# EAGLE design mike_sims_vca (EAGLE 7.1.0)
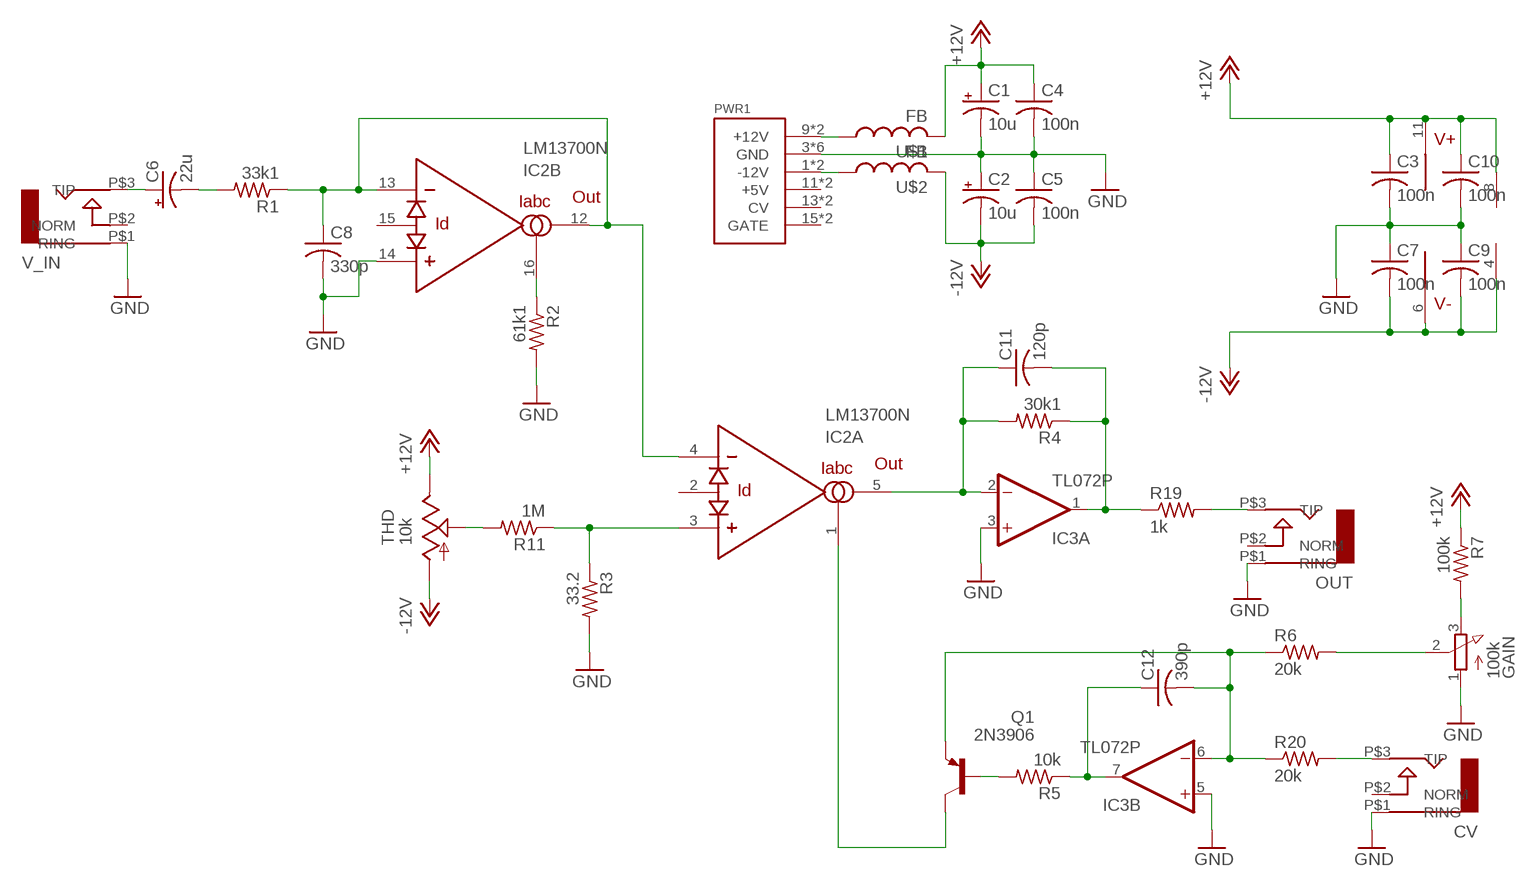
[diagram p0: schematic, sheet 1]

## Parts
C1  10u  CPOL-USB45181A  [B45181A]
C2  10u  CPOL-USB45181A  [B45181A]
C3  100n  C-US050-024X044  [C050-024X044]
C4  100n  C-US050-024X044  [C050-024X044]
C5  100n  C-US050-024X044  [C050-024X044]
C6  22u  CPOL-USB45181A  [B45181A]
C7  100n  C-US050-024X044  [C050-024X044]
C8  330p  C-US050-024X044  [C050-024X044]
C9  100n  C-US050-024X044  [C050-024X044]
C10  100n  C-US050-024X044  [C050-024X044]
C11  120p  C-US050-024X044  [C050-024X044]
C12  390p  C-US050-024X044  [C050-024X044]
CV  AUDIO-JACK  [ERTHENVAR-JACK-90DEG]
GAIN  100k  3RP/1610N  [3RP/1610N]
IC2  LM13700N  [DIL16]
IC3  TL072P  [DIL08]
OUT  AUDIO-JACK  [ERTHENVAR-JACK-90DEG]
PWR1  POWER  [POWER_16]
Q1  2N3906  [TO92]
R1  33k1  R-US_0207/10  [0207/10]
R2  61k1  R-US_0207/10  [0207/10]
R3  33.2  R-US_0207/10  [0207/10]
R4  30k1  R-US_0207/10  [0207/10]
R5  10k  R-US_0207/10  [0207/10]
R6  20k  R-US_0207/10  [0207/10]
R7  100k  R-US_0207/10  [0207/10]
R11  1M  R-US_0207/10  [0207/10]
R19  1k  R-US_0207/10  [0207/10]
R20  20k  R-US_0207/10  [0207/10]
THD  10k  TRIM_US-B64Y  [B64Y]
U$1  FB  [FB]
U$2  FB  [FB]
V_IN  AUDIO-JACK  [ERTHENVAR-JACK-90DEG]

## Nets
+12V: C1.+ C3.1 C4.1 C10.1 IC2.11(V+) IC3.8(P:V+) R7.1 THD.E U$1.P$2
-12V: C2.- C5.2 C7.2 C9.2 IC2.6(V-) IC3.4(P:V-) THD.A U$2.P$2
GND: C1.- C2.+ C3.2 C4.2 C5.1 C7.1 C8.2 C9.1 C10.2 CV.P$1(RING) GAIN.1(A) IC2.14(B:+IN) IC3.3(A:+IN) IC3.5(B:+IN) OUT.P$1(RING) PWR1.3(GND) PWR1.4(GND) PWR1.5(GND) PWR1.6(GND) PWR1.7(GND) PWR1.8(GND) R2.2 R3.2 V_IN.P$1(RING)
N$1: PWR1.9(+12V) PWR1.10(+12V) U$1.P$1
N$2: PWR1.1(-12V) PWR1.2(-12V) U$2.P$1
N$3: C6.+ V_IN.P$3(TIP)
N$4: C6.- R1.2
N$5: C8.1 IC2.4(A:-IN) IC2.12(B:OUT) IC2.13(B:-IN) R1.1
N$6: IC2.3(A:+IN) R3.1 R11.1
N$7: IC2.16(B:IABC) R2.1
N$8: C11.2 IC3.1(A:OUT) R4.1 R19.1
N$9: C11.1 IC2.5(A:OUT) IC3.2(A:-IN) R4.2
N$10: Q1.2(B) R5.2
N$11: C12.1 IC3.7(B:OUT) R5.1
N$12: GAIN.2(S) R6.2
N$13: GAIN.3(E) R7.2
N$19: R11.2 THD.S
N$20: C12.2 IC3.6(B:-IN) Q1.3(E) R6.1 R20.1
N$21: IC2.1(A:IABC) Q1.1(C)
N$24: OUT.P$3(TIP) R19.2
N$25: CV.P$3(TIP) R20.2
Unconnected: CV.P$2(NORM) IC2.2(A:ID) IC2.7(IN) IC2.8(OUT) IC2.9(OUT) IC2.10(IN) IC2.15(B:ID) OUT.P$2(NORM) PWR1.11(+5V) PWR1.12(+5V) PWR1.13(CV) PWR1.14(CV) PWR1.15(GATE) PWR1.16(GATE) V_IN.P$2(NORM)

## Library data of the parts
C1 C2 C6 = rcl:CPOL-US: POLARIZED CAPACITOR, American symbol
C3-C5 C7-C12 = rcl:C-US: CAPACITOR, American symbol
CV OUT V_IN = erthenvar:AUDIO-JACK: Switching Mono 3.5mm Audio Jack from Erthenvar.
GAIN = pot:3RP/1610N: 16mm Potentiometer one level Source: http://www.alphapotentiometers.net/html/16mm_pot_2.html
IC2 = synthdiy updated imperial:LM13700: National Dual OTA with buffers.
IC3 = linear:TL072: OP AMP
PWR1 = eurorack:POWER
Q1 = transistor-pnp:2N3906: PNP Transistor
R1-R7 R11 R19 R20 = rcl:R-US_: RESISTOR, American symbol
THD = pot:TRIM_US-: POTENTIOMETER
U$1 U$2 = adafruit:FB: Ferrite bead Digikey #P9821BK-ND

## Board
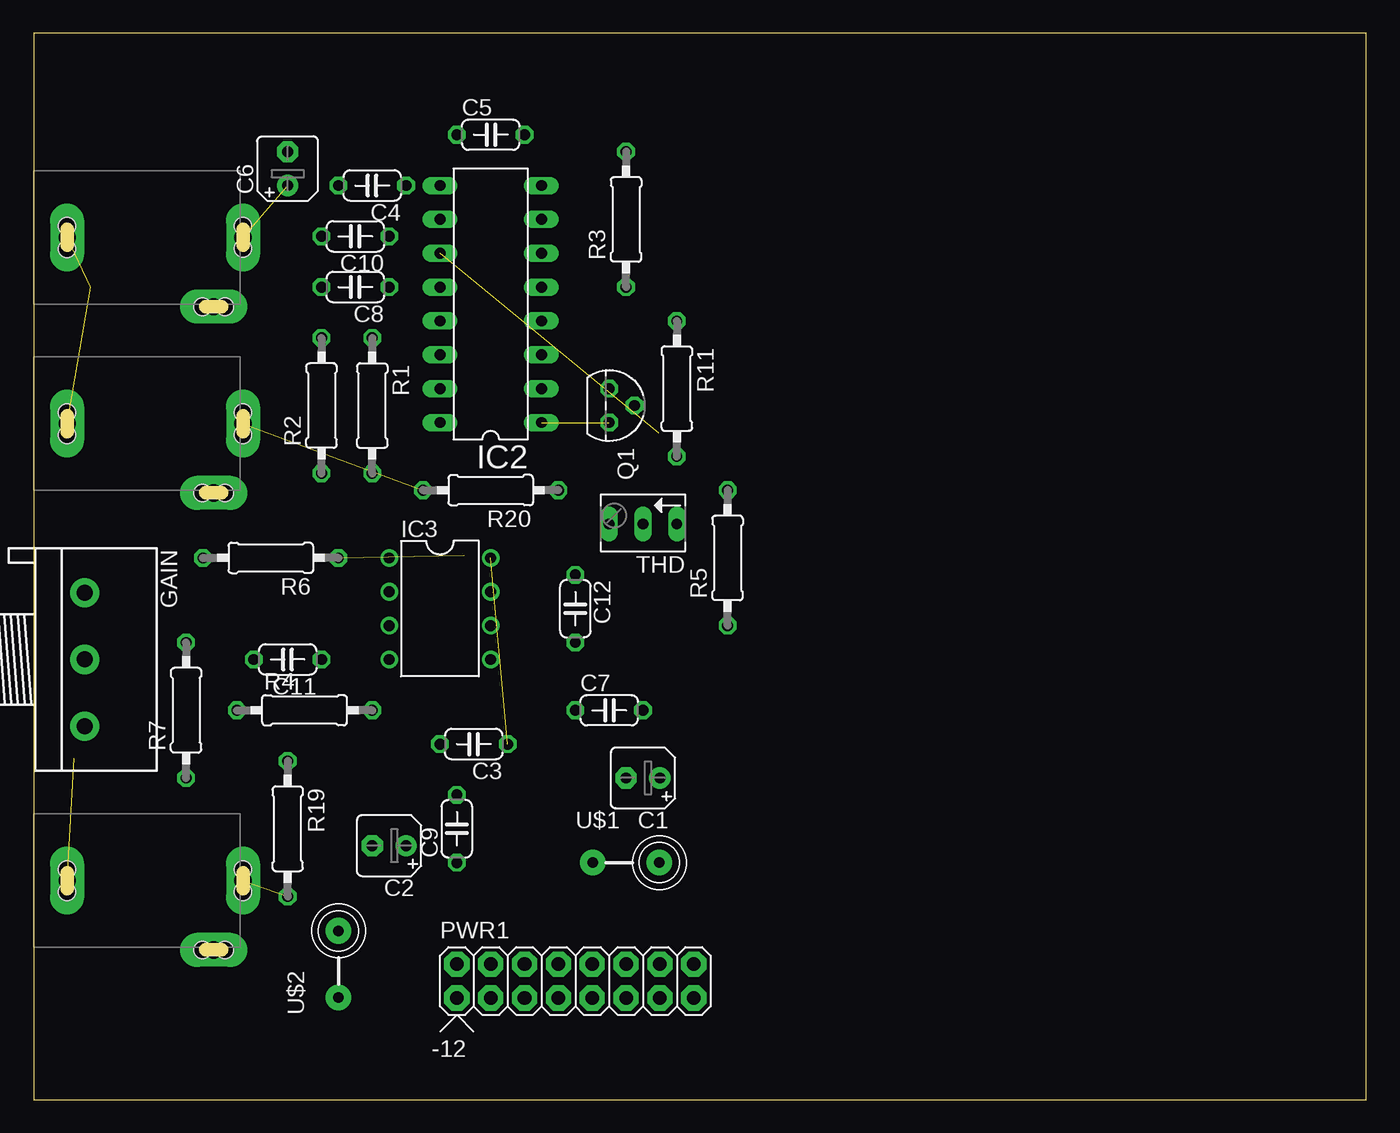
[diagram p1: board, top side]
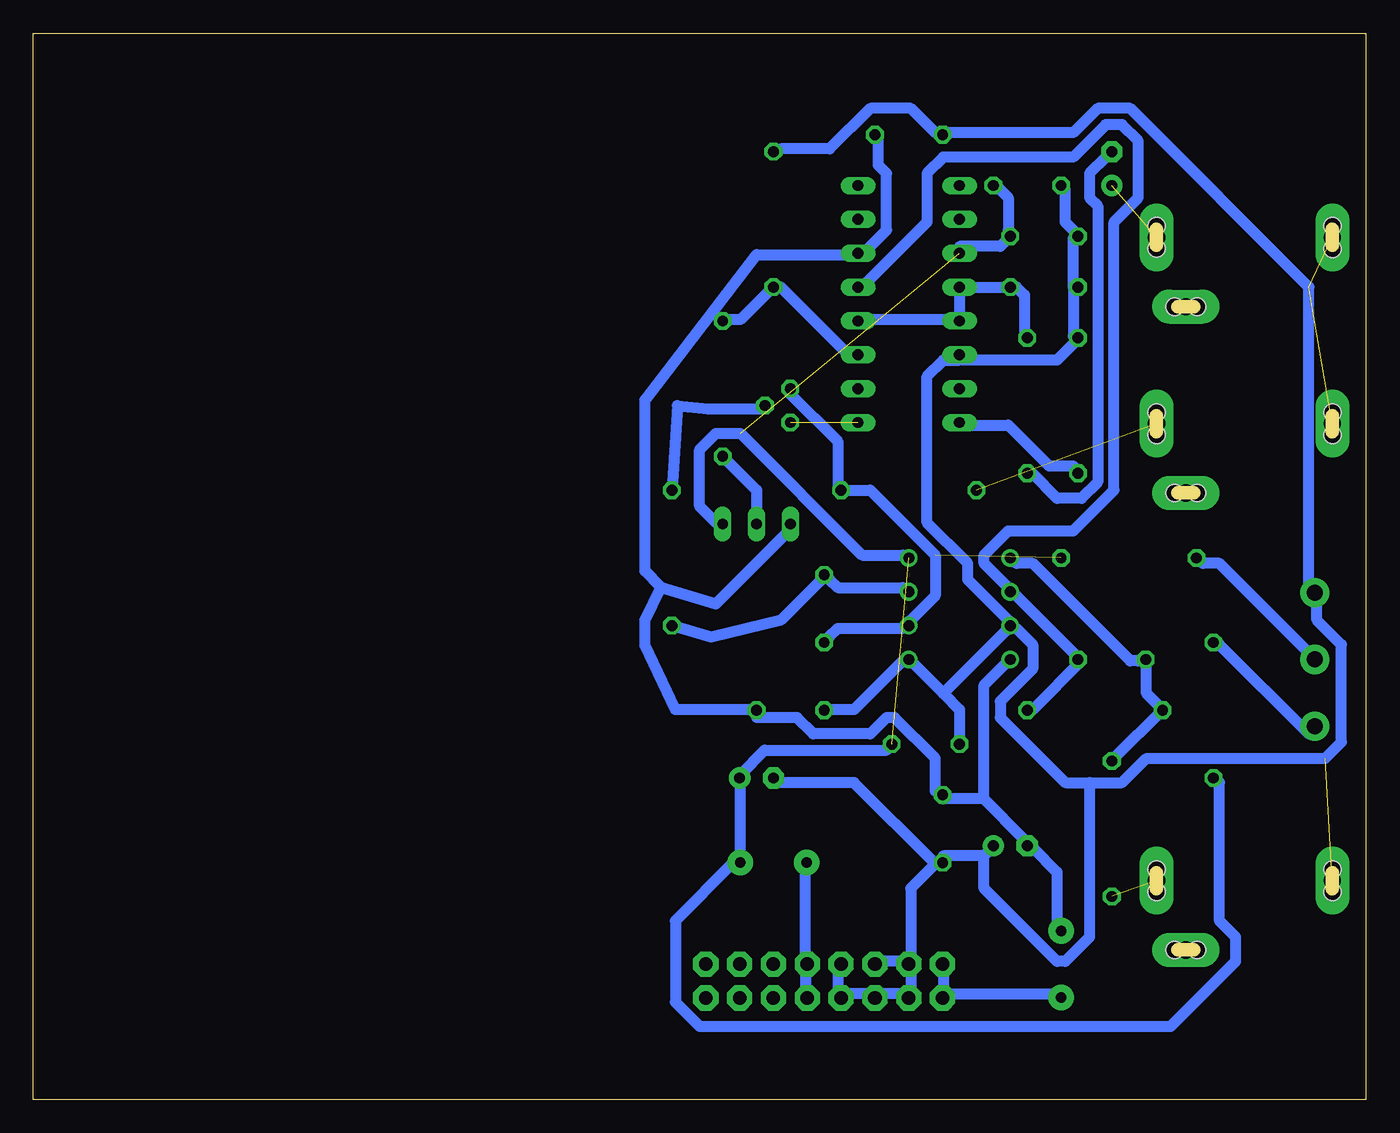
[diagram p2: board, bottom side, seen from below]

Size 100 x 80 mm. Coordinates in mm from the lower left corner, seen from the top.
Outline: 0,0 100,0 100,80 0,80 0,0
Copper layers (1*16): Top 0.035mm / dielectric 1.5mm / Bottom 0.035mm
Design rules "default *": minimum track width 32mil, minimum drill 31mil, track to track 16mil, track to pad 16mil, pad to pad 16mil, via to via 16mil, smd to smd 8mil, copper to edge 0mil, drill to drill 16mil, minimum pad ring 10mil, minimum via ring 8mil, stop-mask expansion 4mil, vias tented up to drill 0mil, thermal gap 10mil

### Footprints (pad centres in the part's own frame; a part is rotated, then mirrored left to right if it is on the bottom)
B45181A = drill 0.813 pad 1.6: + -1.27,0 | drill 0.813 pad 1.6 octagon: - 1.27,0
C050-024X044 = drill 0.813 octagon: 1 -2.54,0; 2 2.54,0
ERTHENVAR-JACK-90DEG = drill 1.3 pad 2.54 long: P$1 5,-2.5; P$2 -0.2,-13.5; P$3 5,-15.7 | hole 1.3: 5.842,-2.489; 4.14,-2.489; -0.203,-12.649; -0.203,-14.351; 5.842,-15.697; 4.166,-15.697
3RP/1610N = drill 1.2 pad 2.184: 1 -5,0; 2 0,0; 3 5,0
DIL16 = drill 0.813 long: 1 -8.89,-3.81; 2 -6.35,-3.81; 3 -3.81,-3.81; 4 -1.27,-3.81; 5 1.27,-3.81; 6 3.81,-3.81; 7 6.35,-3.81; 8 8.89,-3.81; 9 8.89,3.81; 10 6.35,3.81; 11 3.81,3.81; 12 1.27,3.81; 13 -1.27,3.81; 14 -3.81,3.81; 15 -6.35,3.81; 16 -8.89,3.81
DIL08 = drill 0.813 pad 1.27: 1 -3.81,-3.81; 2 -1.27,-3.81; 3 1.27,-3.81; 4 3.81,-3.81; 5 3.81,3.81; 6 1.27,3.81; 7 -1.27,3.81; 8 -3.81,3.81
POWER_16 = drill 1.016 pad 1.88 octagon: 1 -6.35,-1.27; 2 -6.35,1.27; 3 -3.81,-1.27; 4 -3.81,1.27; 5 -1.27,-1.27; 6 -1.27,1.27; 7 1.27,-1.27; 8 1.27,1.27; 9 3.81,-1.27; 10 3.81,1.27; 11 6.35,-1.27; 12 6.35,1.27; 13 8.89,-1.27; 14 8.89,1.27; 15 11.43,-1.27; 16 11.43,1.27
TO92 = drill 0.813 octagon: 1 1.27,0; 2 0,1.905; 3 -1.27,0
0207/10 = drill 0.813 octagon: 1 -5.08,0; 2 5.08,0
B64Y = drill 0.813 long: A 2.54,0; E -2.54,0; S 0,0
FB = drill 0.8 pad 1.93: P$1 -2.5,0; P$2 2.5,0

### Placement (x,y rotation side)
C1  45.72,24.13 180 top
C2  26.67,19.05 180 top
C3  33.02,26.67 180 top
C4  25.4,68.58 180 top
C5  34.29,72.39 0 top
C6  19.05,69.85 90 top
C7  43.18,29.21 0 top
C8  24.13,60.96 180 top
C9  31.75,20.32 90 top
C10  24.13,64.77 180 top
C11  19.05,33.02 180 top
C12  40.64,36.83 270 top
CV  0,45.72 90 top
GAIN  3.81,33.02 270 top
IC2  34.29,59.69 90 top
IC3  30.48,36.83 270 top
OUT  0,11.43 90 top
PWR1  38.1,8.89 0 top
Q1  43.18,52.07 270 top
R1  25.4,52.07 270 top
R2  21.59,52.07 90 top
R3  44.45,66.04 90 top
R4  20.32,29.21 0 top
R5  52.07,40.64 90 top
R6  17.78,40.64 180 top
R7  11.43,29.21 90 top
R11  48.26,53.34 270 top
R19  19.05,20.32 270 top
R20  34.29,45.72 180 top
THD  45.72,43.18 180 top
U$1  44.45,17.78 0 top
U$2  22.86,10.16 90 top
V_IN  0,59.69 90 top

### Tracks (layer width: path | path; a pad name or v marks a point on that pad's centre or on a via)
+12V  (2 unrouted)
  Bottom 0.813: C3.1 35.97,26.21 45.11,26.21 46.94,24.38 C1.+ 46.94,23.77 46.94,18.29 U$1.P$2 47.55,17.68 51.82,13.41 51.82,7.32 49.99,5.49 14.63,5.49 9.75,10.36 9.75,12.19 10.97,13.41 10.97,23.77 R7.1 | C4.1 27.43,68.28 26.82,67.67 26.82,65.23 C10.1 27.43,64.01 30.48,64.01 IC2.11 | IC3.8 34.75,40.84 37.8,40.84 46.94,49.99 48.77,49.99 49.99,48.77 49.99,44.5 48.77,43.28 THD.E
-12V
  Bottom 0.813: C5.2 36.58,71.93 36.58,70.1 35.97,69.49 35.97,65.23 37.8,63.4 IC2.6 38.41,63.4 45.72,63.4 54.1,52.48 54.1,39.67 52.88,38.46 | 28.65,22.55 31.7,22.55 C9.2 32.31,23.16 32.31,25.6 35.36,28.65 35.97,28.65 37.19,27.43 41.45,27.43 42.67,28.65 45.72,28.65 C7.2 45.72,29.26 51.82,29.26 54.1,34.09 54.1,35.97 52.88,38.46 | 28.65,22.55 25.6,19.51 C2.- 24.99,18.9 23.16,17.07 23.16,12.8 U$2.P$2 | 28.65,22.55 28.65,31.09 26.82,32.92 IC3.4 | 52.88,38.46 48.77,37.19 43.28,42.67 THD.A
GND  (3 unrouted)
  Bottom 0.813: PWR1.8 39.62,9.75 39.62,7.92 PWR1.7 39.01,7.92 37.19,7.92 PWR1.5 36.58,7.92 34.75,7.92 PWR1.3 34.14,7.92 34.14,9.75 PWR1.4 | PWR1.6 36.58,10.36 34.75,10.36 PWR1.4 | 28.65,18.29 31.7,18.29 C9.1 32.31,17.68 | 28.65,18.29 28.04,18.9 C2.+ | 32.31,17.68 38.41,23.77 43.89,23.77 C1.- | 32.31,17.68 34.14,15.85 34.14,10.36 PWR1.4 | 21.95,60.96 21.95,57.3 R2.2 21.95,56.69 23.16,55.47 30.48,55.47 | 21.95,60.96 21.95,64.62 C10.2 21.95,65.23 22.55,65.84 22.55,68.28 C4.2 | 21.95,60.96 C8.2 | R3.2 43.89,71.32 40.23,71.32 37.19,74.37 34.14,74.37 32.31,72.54 C5.1 31.7,72.54 21.95,72.54 20.12,74.37 17.68,74.37 4.27,60.96 4.27,38.41 GAIN.1 3.66,37.8 3.66,35.97 1.83,34.14 1.83,26.82 3.05,25.6 16.46,25.6 18.29,23.77 20.73,23.77 | C3.2 30.48,29.26 31.7,30.48 | 31.7,30.48 34.14,32.92 IC3.5 34.75,32.92 38.41,29.26 40.23,29.26 C7.1 | 31.7,30.48 26.82,35.36 IC3.3 | 20.73,23.77 22.55,23.77 27.43,28.65 27.43,29.87 24.99,32.31 24.99,34.14 26.21,35.36 IC3.3 | 30.48,55.47 31.7,55.47 32.92,54.25 32.92,43.28 29.87,40.23 29.87,39.01 26.82,35.97 IC3.3 | 30.48,55.47 IC2.14 | 28.65,18.29 28.65,15.85 23.16,10.36 22.55,10.36 20.73,12.19 20.73,23.77
N$1
  Bottom 0.813: PWR1.9 42.06,7.92 42.06,9.75 PWR1.10 42.06,10.36 42.06,17.68 U$1.P$1
N$2
  Bottom 0.813: 31.7,7.92 31.7,9.75 PWR1.2 | 31.7,7.92 23.16,7.92 U$2.P$1 | 31.7,7.92 PWR1.1
N$3  (1 unrouted)
N$4
  Bottom 0.813: R1.2 24.99,46.94 23.16,45.11 21.34,45.11 20.12,46.33 20.12,67.06 20.73,67.67 20.73,69.49 19.51,70.71 C6.-
N$5
  Bottom 0.813: R1.1 25.6,57.3 25.6,60.35 26.21,60.96 C8.1 IC2.12 30.48,58.52 | 30.48,58.52 37.8,58.52 IC2.4 | 30.48,58.52 IC2.13
N$6
  Bottom 0.813: IC2.3 38.41,56.08 39.01,56.08 43.89,60.96 R3.1 44.5,60.96 46.94,58.52 48.16,58.52 R11.1
N$7
  Bottom 0.813: R2.1 21.95,47.55 23.77,47.55 26.82,50.6 30.48,50.6 IC2.16
N$8
  Bottom 0.813: 15.24,29.26 18.9,25.6 R19.1 | 15.24,29.26 16.46,30.48 16.46,32.92 C11.2 17.07,32.92 17.68,32.92 24.99,40.23 26.21,40.23 IC3.1 | 15.24,29.26 R4.1
N$9
  Bottom 0.813: R4.2 24.99,29.26 21.34,32.92 C11.1 21.95,33.53 26.21,37.8 IC3.2 26.82,38.41 28.65,40.23 28.65,40.84 26.82,42.67 21.95,42.67 18.9,45.72 18.9,65.84 17.07,67.67 17.07,71.93 18.29,73.15 19.51,73.15 21.95,70.71 31.7,70.71 32.92,69.49 32.92,65.84 37.8,60.96 IC2.5
N$10
  Bottom 0.813: Q1.2 45.11,51.82 49.38,51.82 51.66,52.07 R5.2
N$11
  Bottom 0.813: IC3.7 34.75,38.41 39.62,38.41 40.23,39.01 C12.1 40.84,39.01 43.89,35.97 49.12,34.7 R5.1
N$12
  Bottom 0.813: R6.2 12.19,40.23 10.97,40.23 4.27,33.53 GAIN.2
N$13
  Bottom 0.813: R7.2 10.97,34.14 4.27,27.43 GAIN.3
N$19
  Bottom 0.813: THD.S 45.72,45.72 R11.2
N$20  (1 unrouted)
  Bottom 0.813: C12.2 40.23,34.75 39.62,35.36 34.75,35.36 IC3.6 34.14,35.97 32.31,37.8 32.31,40.84 37.19,45.72 R20.1 39.62,45.72 39.62,49.38 43.28,53.03 Q1.3
N$21  (1 unrouted)
N$24  (1 unrouted)
N$25  (1 unrouted)